# EAGLE schematic example_led (EAGLE 6.6.0)
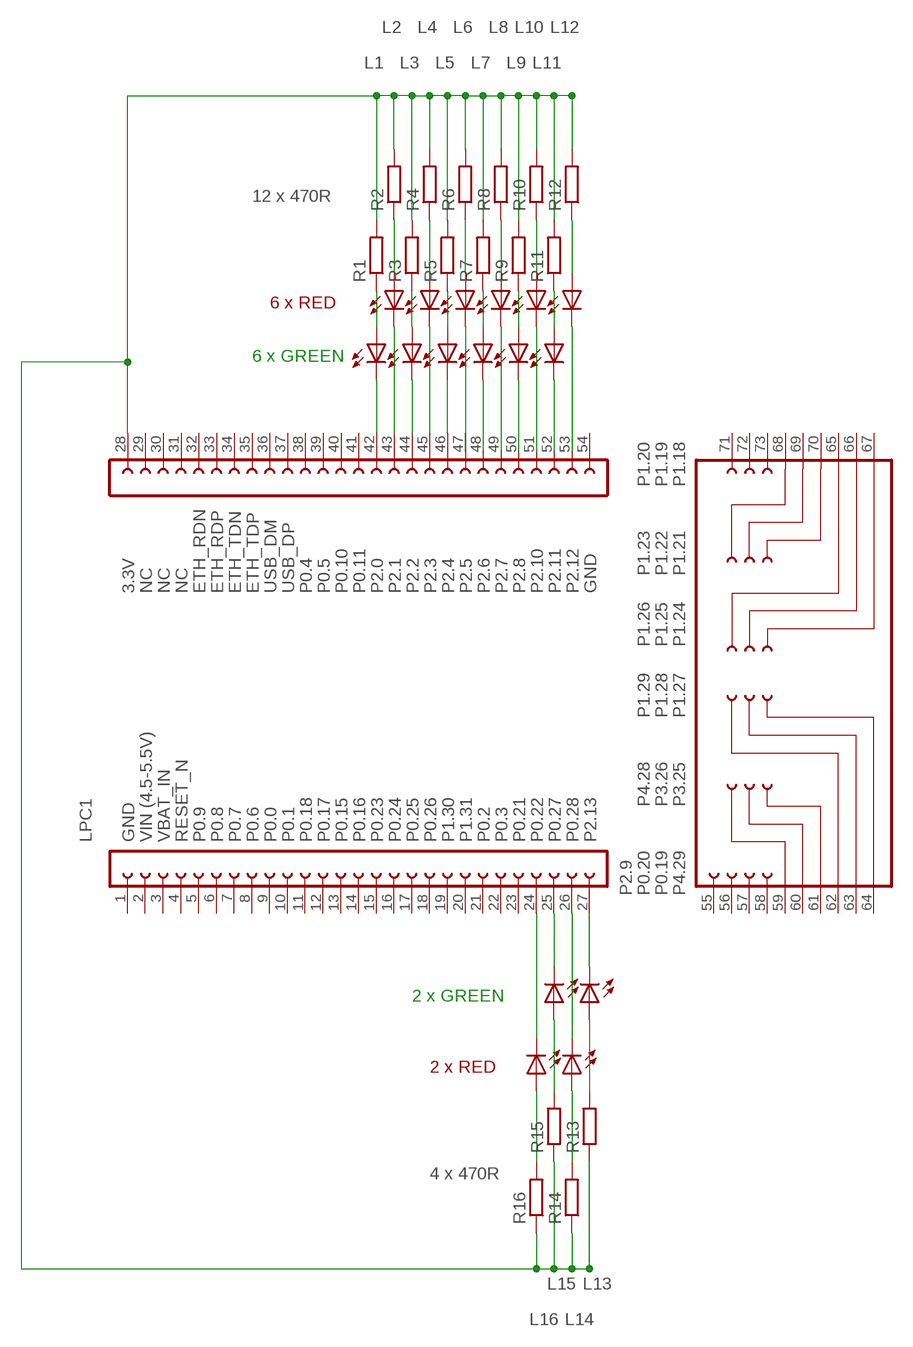
[diagram p0: schematic, sheet 1]

## Parts
L1  LRP4-TOP  [P47F-TOP]
L2  LRP4-TOP  [P47F-TOP]
L3  LRP4-TOP  [P47F-TOP]
L4  LRP4-TOP  [P47F-TOP]
L5  LRP4-TOP  [P47F-TOP]
L6  LRP4-TOP  [P47F-TOP]
L7  LRP4-TOP  [P47F-TOP]
L8  LRP4-TOP  [P47F-TOP]
L9  LRP4-TOP  [P47F-TOP]
L10  LRP4-TOP  [P47F-TOP]
L11  LRP4-TOP  [P47F-TOP]
L12  LRP4-TOP  [P47F-TOP]
L13  LRP4-TOP  [P47F-TOP]
L14  LRP4-TOP  [P47F-TOP]
L15  LRP4-TOP  [P47F-TOP]
L16  LRP4-TOP  [P47F-TOP]
LPC1  LPCXPRESSO_LPC1769  [LPCXPRESSO_LPC1769]
R1  470R  R-EU_0204/2V  [0204V]
R2  470R  R-EU_0204/2V  [0204V]
R3  470R  R-EU_0204/2V  [0204V]
R4  470R  R-EU_0204/2V  [0204V]
R5  470R  R-EU_0204/2V  [0204V]
R6  470R  R-EU_0204/2V  [0204V]
R7  470R  R-EU_0204/2V  [0204V]
R8  470R  R-EU_0204/2V  [0204V]
R9  470R  R-EU_0204/2V  [0204V]
R10  470R  R-EU_0204/2V  [0204V]
R11  470R  R-EU_0204/2V  [0204V]
R12  470R  R-EU_0204/2V  [0204V]
R13  470R  R-EU_0204/2V  [0204V]
R14  470R  R-EU_0204/2V  [0204V]
R15  470R  R-EU_0204/2V  [0204V]
R16  470R  R-EU_0204/2V  [0204V]

## Nets
N$1: L1.C LPC1.42
N$2: L2.C LPC1.43
N$3: L1.A R1.1
N$4: L2.A R2.1
N$5: LPC1.28 R1.2 R2.2 R3.2 R4.2 R5.2 R6.2 R7.2 R8.2 R9.2 R10.2 R11.2 R12.2 R13.1 R14.1 R15.1 R16.1
N$6: L3.C LPC1.44
N$7: L4.C LPC1.45
N$8: L3.A R3.1
N$9: L4.A R4.1
N$10: L5.A R5.1
N$11: L5.C LPC1.46
N$12: L6.C LPC1.47
N$13: L6.A R6.1
N$14: L12.A R12.1
N$15: L12.C LPC1.53
N$16: L11.C LPC1.52
N$17: L10.C LPC1.51
N$18: L9.C LPC1.50
N$19: L8.C LPC1.49
N$20: L7.C LPC1.48
N$21: L7.A R7.1
N$22: L9.A R9.1
N$23: L11.A R11.1
N$24: L8.A R8.1
N$25: L10.A R10.1
N$26: L13.C LPC1.27
N$27: L14.C LPC1.26
N$28: L13.A R13.2
N$29: L15.C LPC1.25
N$30: L16.C LPC1.24
N$31: L16.A R16.2
N$32: L15.A R15.2
N$33: L14.A R14.2
Unconnected: LPC1.1 LPC1.2 LPC1.3 LPC1.4 LPC1.5 LPC1.6 LPC1.7 LPC1.8 LPC1.9 LPC1.10 LPC1.11 LPC1.12 LPC1.13 LPC1.14 LPC1.15 LPC1.16 LPC1.17 LPC1.18 LPC1.19 LPC1.20 LPC1.21 LPC1.22 LPC1.23 LPC1.29 LPC1.30 LPC1.31 LPC1.32 LPC1.33 LPC1.34 LPC1.35 LPC1.36 LPC1.37 LPC1.38 LPC1.39 LPC1.40 LPC1.41 LPC1.54 LPC1.55 LPC1.56 LPC1.57 LPC1.58 LPC1.59 LPC1.60 LPC1.61 LPC1.62 LPC1.63 LPC1.64 LPC1.65 LPC1.66 LPC1.67 LPC1.68 LPC1.69 LPC1.70 LPC1.71 LPC1.72 LPC1.73

## Notes on the sheet
- 12 x 470R
- 6 x RED
- 6 x GREEN
- 2 x GREEN
- 2 x RED
- 4 x 470R

## Library data of the parts
L1-L16 = led:*P4: PointLED® Enhanced Thinfilm LED TOP & BOTTOM mount LS P47F, LR P47F, LA P47F, LY P47F, LT P4SG, LB P4SG, LW P4SG Source: http://catalog.osram-os.com .. LA_LR_LS_LY_P47F_Pb_free.pdf
LPC1 = lpc:LPCXPRESSO_LPC1769
R1-R16 = resistor:R-EU_: RESISTOR, European symbol